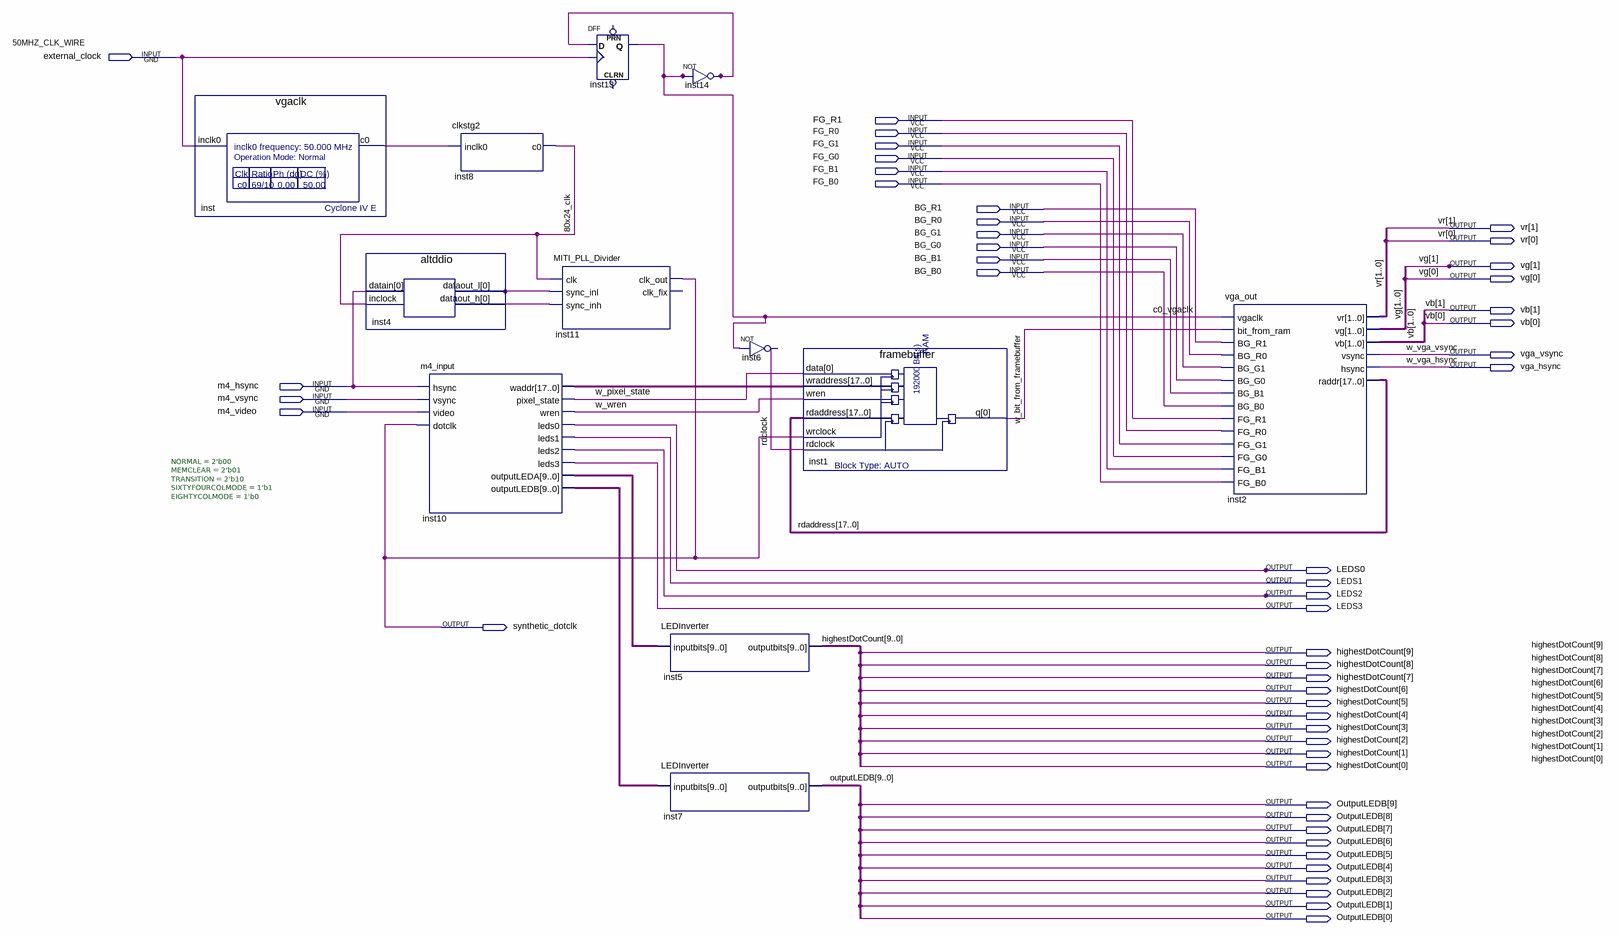
[diagram p0: schematic sheet]
// Quartus schematic M4ToVGA_top.bdf as structural Verilog: 12 symbols, 49 pins
module M4ToVGA_top (
  input  external_clock,
  input  FG_R1,
  input  FG_R0,
  input  FG_G1,
  input  FG_G0,
  input  FG_B1,
  input  FG_B0,
  input  BG_R1,
  input  BG_R0,
  input  BG_G1,
  input  BG_G0,
  input  BG_B1,
  input  BG_B0,
  input  m4_hsync,
  input  m4_vsync,
  input  m4_video,
  output [1:0] vr,
  output [1:0] vg,
  output [1:0] vb,
  output vga_vsync,
  output vga_hsync,
  output LEDS0,
  output LEDS1,
  output LEDS2,
  output LEDS3,
  output synthetic_dotclk,
  output [9:0] highestDotCount,
  output [9:0] OutputLEDB
);

  wire \80x24_clk , c0_vgaclk, inst4_dataout_h, inst4_dataout_l, inst14_out, inst_c0, rdclock,
       w_bit_from_framebuffer, w_pixel_state, w_wren;
  wire [9:0] inst10_outputleda, inst10_outputledb;
  wire [17:0] inst10_waddr, rdaddress;

  vgaclk inst (.inclk0(external_clock), .c0(inst_c0));
  altddio inst4 (.datain(m4_hsync), .inclock(\80x24_clk ), .dataout_l(inst4_dataout_l), .dataout_h(inst4_dataout_h));
  m4_input #(.NORMAL(2'b00), .MEMCLEAR(2'b01), .TRANSITION(2'b10), .SIXTYFOURCOLMODE(1'b1), .EIGHTYCOLMODE(1'b0)) inst10 (
    .hsync(m4_hsync), .vsync(m4_vsync), .video(m4_video), .dotclk(synthetic_dotclk), .waddr(inst10_waddr),
    .pixel_state(w_pixel_state), .wren(w_wren), .leds0(LEDS0), .leds1(LEDS1), .leds2(LEDS2), .leds3(LEDS3),
    .outputLEDA(inst10_outputleda), .outputLEDB(inst10_outputledb));
  clkstg2 inst8 (.inclk0(inst_c0), .c0(\80x24_clk ));
  MITI_PLL_Divider inst11 (
    .clk(\80x24_clk ), .sync_inl(inst4_dataout_l), .sync_inh(inst4_dataout_h), .clk_out(synthetic_dotclk));  // open: clk_fix
  DFF inst13 (.CLK(external_clock), .D(inst14_out), .Q(c0_vgaclk));  // open: CLRN, PRN
  LEDInverter inst5 (.inputbits(inst10_outputleda), .outputbits(highestDotCount));
  LEDInverter inst7 (.inputbits(inst10_outputledb), .outputbits(OutputLEDB));
  not inst14 (inst14_out, c0_vgaclk);
  not inst6 (rdclock, c0_vgaclk);
  framebuffer inst1 (
    .data(w_pixel_state), .wraddress(inst10_waddr), .wren(w_wren), .rdaddress(rdaddress),
    .wrclock(synthetic_dotclk), .rdclock(rdclock), .q(w_bit_from_framebuffer));
  vga_out inst2 (
    .vgaclk(c0_vgaclk), .bit_from_ram(w_bit_from_framebuffer), .BG_R1(BG_R1), .BG_R0(BG_R0), .BG_G1(BG_G1),
    .BG_G0(BG_G0), .BG_B1(BG_B1), .BG_B0(BG_B0), .FG_R1(FG_R1), .FG_R0(FG_R0), .FG_G1(FG_G1), .FG_G0(FG_G0),
    .FG_B1(FG_B1), .FG_B0(FG_B0), .vr(vr), .vg(vg), .vb(vb), .vsync(vga_vsync), .hsync(vga_hsync),
    .raddr(rdaddress));

  // Other names for the same wires on the sheet: 50MHZ_CLK_WIRE = external_clock; w_vga_hsync = vga_hsync;
  //   w_vga_vsync = vga_vsync
endmodule
